# EAGLE schematic StepperSynth2.3_Interface (EAGLE 9.2.2)
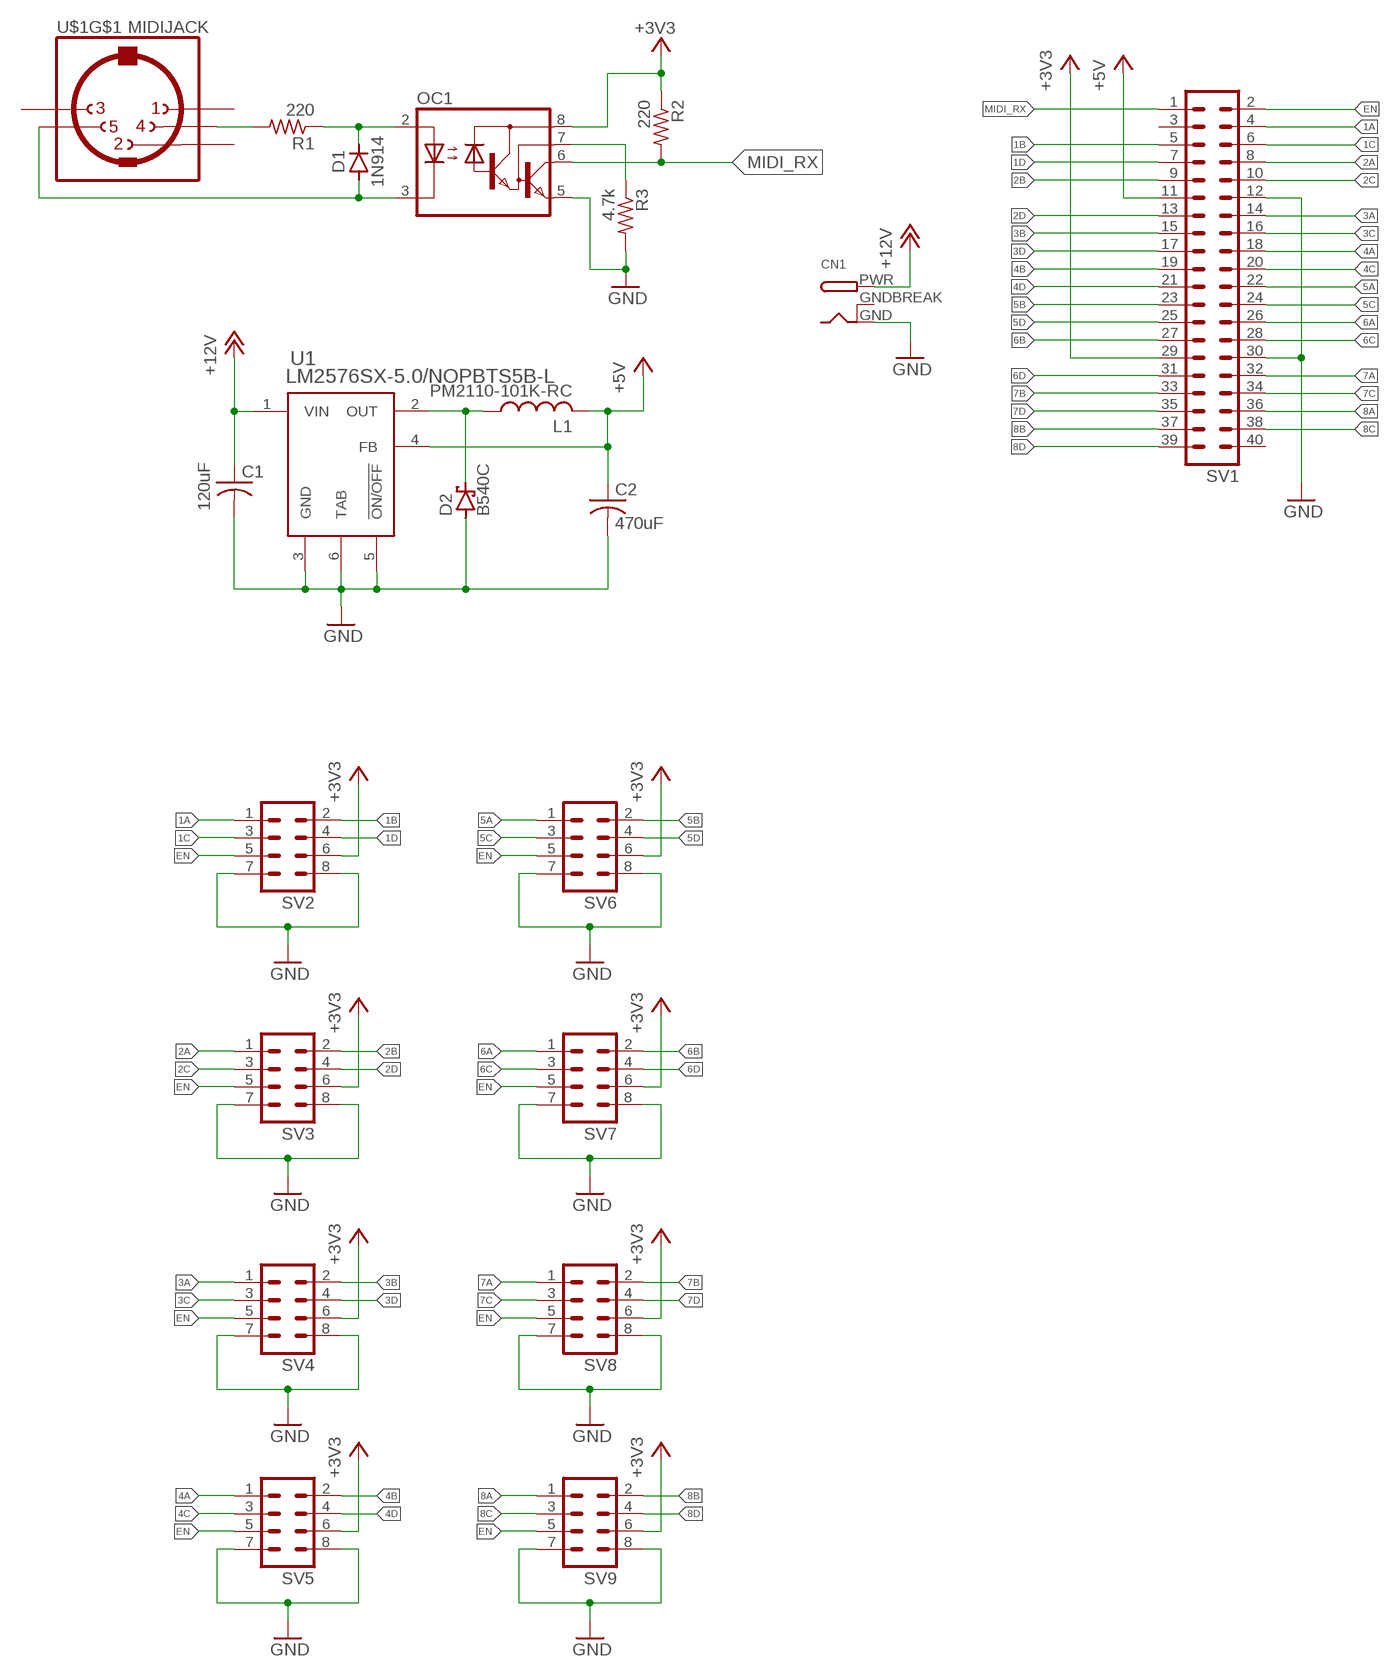
[diagram p0: schematic, sheet 1]

## Parts
C1  120uF  20SVPF120MPCAP_SVP_C6-L  [PCAP_SVP_C6-L]
C2  470uF  UUD1A471MNL1GSU2-P-L  [U2-P-L]
CN1  DCBARRELPTH  [DCJACK_2MM_PTH]
D1  1N914  [DO35-7]
D2  B540C  SCHOTTKY-DIODESMC  [SMC]
L1  PM2110-101K-RC  [IND_PM2110]
OC1  6N138  [DIL08]
R1  220  R-US_0204/5  [0204/5]
R2  220  R-US_0204/5  [0204/5]
R3  4.7k  R-US_0204/5  [0204/5]
SV1  MA20-2  [MA20-2]
SV2  MA04-2  [MA04-2]
SV3  MA04-2  [MA04-2]
SV4  MA04-2  [MA04-2]
SV5  MA04-2  [MA04-2]
SV6  MA04-2  [MA04-2]
SV7  MA04-2  [MA04-2]
SV8  MA04-2  [MA04-2]
SV9  MA04-2  [MA04-2]
U1  LM2576SX-5.0/NOPBTS5B-L  [TS5B-L]
U$1  MIDIJACK  [CP-2350]

## Nets
1A: SV1.4 SV2.1
1B: SV1.5 SV2.2
1C: SV1.6 SV2.3
1D: SV1.7 SV2.4
2A: SV1.8 SV3.1
2B: SV1.9 SV3.2
2C: SV1.10 SV3.3
2D: SV1.13 SV3.4
3A: SV1.14 SV4.1
3B: SV1.15 SV4.2
3C: SV1.16 SV4.3
3D: SV1.17 SV4.4
4A: SV1.18 SV5.1
4B: SV1.19 SV5.2
4C: SV1.20 SV5.3
4D: SV1.21 SV5.4
5A: SV1.22 SV6.1
5B: SV1.23 SV6.2
5C: SV1.24 SV6.3
5D: SV1.25 SV6.4
6A: SV1.26 SV7.1
6B: SV1.27 SV7.2
6C: SV1.28 SV7.3
6D: SV1.31 SV7.4
7A: SV1.32 SV8.1
7B: SV1.33 SV8.2
7C: SV1.34 SV8.3
7D: SV1.35 SV8.4
8A: SV1.36 SV9.1
8B: SV1.37 SV9.2
8C: SV1.38 SV9.3
8D: SV1.39 SV9.4
+3V3: OC1.8(VCC) R2.1 SV1.29 SV2.6 SV3.6 SV4.6 SV5.6 SV6.6 SV7.6 SV8.6 SV9.6
+5V: C2.1(+) L1.2 SV1.11 U1.4(FB)
+12V: C1.1(+) CN1.PWR U1.1(VIN)
EN: SV1.2 SV2.5 SV3.5 SV4.5 SV5.5 SV6.5 SV7.5 SV8.5 SV9.5
GND: C1.2(-) C2.2(-) CN1.GND D2.A OC1.5(GND) R3.2 SV1.12 SV1.30 SV2.7 SV2.8 SV3.7 SV3.8 SV4.7 SV4.8 SV5.7 SV5.8 SV6.7 SV6.8 SV7.7 SV7.8 SV8.7 SV8.8 SV9.7 SV9.8 U1.3(GND) U1.5(!ON/OFF) U1.6(TAB)
MIDI_RX: OC1.6(VO) R2.2 SV1.1
N$1: R1.2 U$1.4
N$2: D1.C OC1.2(A) R1.1
N$3: D1.A OC1.3(C) U$1.5
N$4: OC1.7(VB) R3.1
N$5: D2.C L1.1 U1.2(OUT)
Unconnected: SV1.3 SV1.40 U$1.1 U$1.2 U$1.3 U$1.PE1(MT) U$1.PE2(MT) U$1.PE(MT) U$1.PE@(MT)

## Power pins joined to a net without a drawn wire
GNDBREAK: CN1.GNDBREAK

## Library data of the parts
C1 = Capacitor:20SVPF120M; MANUFACTURER_PART_NUMBER: 20SVPF120M; VENDOR: Panasonic
C2 = Capacitor:UUD1A471MNL1GS; MANUFACTURER_PART_NUMBER: UUD1A471MNL1GS; VENDOR: Nichicon
CN1 = adafruit:DCBARREL: 2.0mm DC Barrel Jack DCJACK_2MM_PTH - Through Hole Jack (4UConnector: 05537)
D1 = Diodes:1N914
D2 = diode:SCHOTTKY-DIODE: Schottky Diode
L1 = Inductors:PM2110-101K-RC; MANUFACTURER_PART_NUMBER: PM2110101KRC; VENDOR: Bourns Electronics
OC1 = optocoupler:6N138: MOTOROLA OPTO COUPLER
R1-R3 = adafruit:R-US_: RESISTOR, American symbol
SV1 = con-lstb:MA20-2: PIN HEADER; OC_FARNELL: unknown; OC_NEWARK: unknown
SV2-SV9 = con-lstb:MA04-2: PIN HEADER; OC_FARNELL: unknown; OC_NEWARK: unknown
U1 = LM2576SX-5.0NOPB:LM2576SX-5.0/NOPB; MANUFACTURER_PART_NUMBER: LM2576SX5.0NOPB; VENDOR: Texas Instruments
U$1 = adafruit:MIDIJACK: DIN 5 jack also known as MIDI jack A modification of conn-hirshman:MAB5SH with two options for the grounding 'teeth'